# EAGLE design Adafruit tfttouchshield v2.2 (EAGLE 6.3)
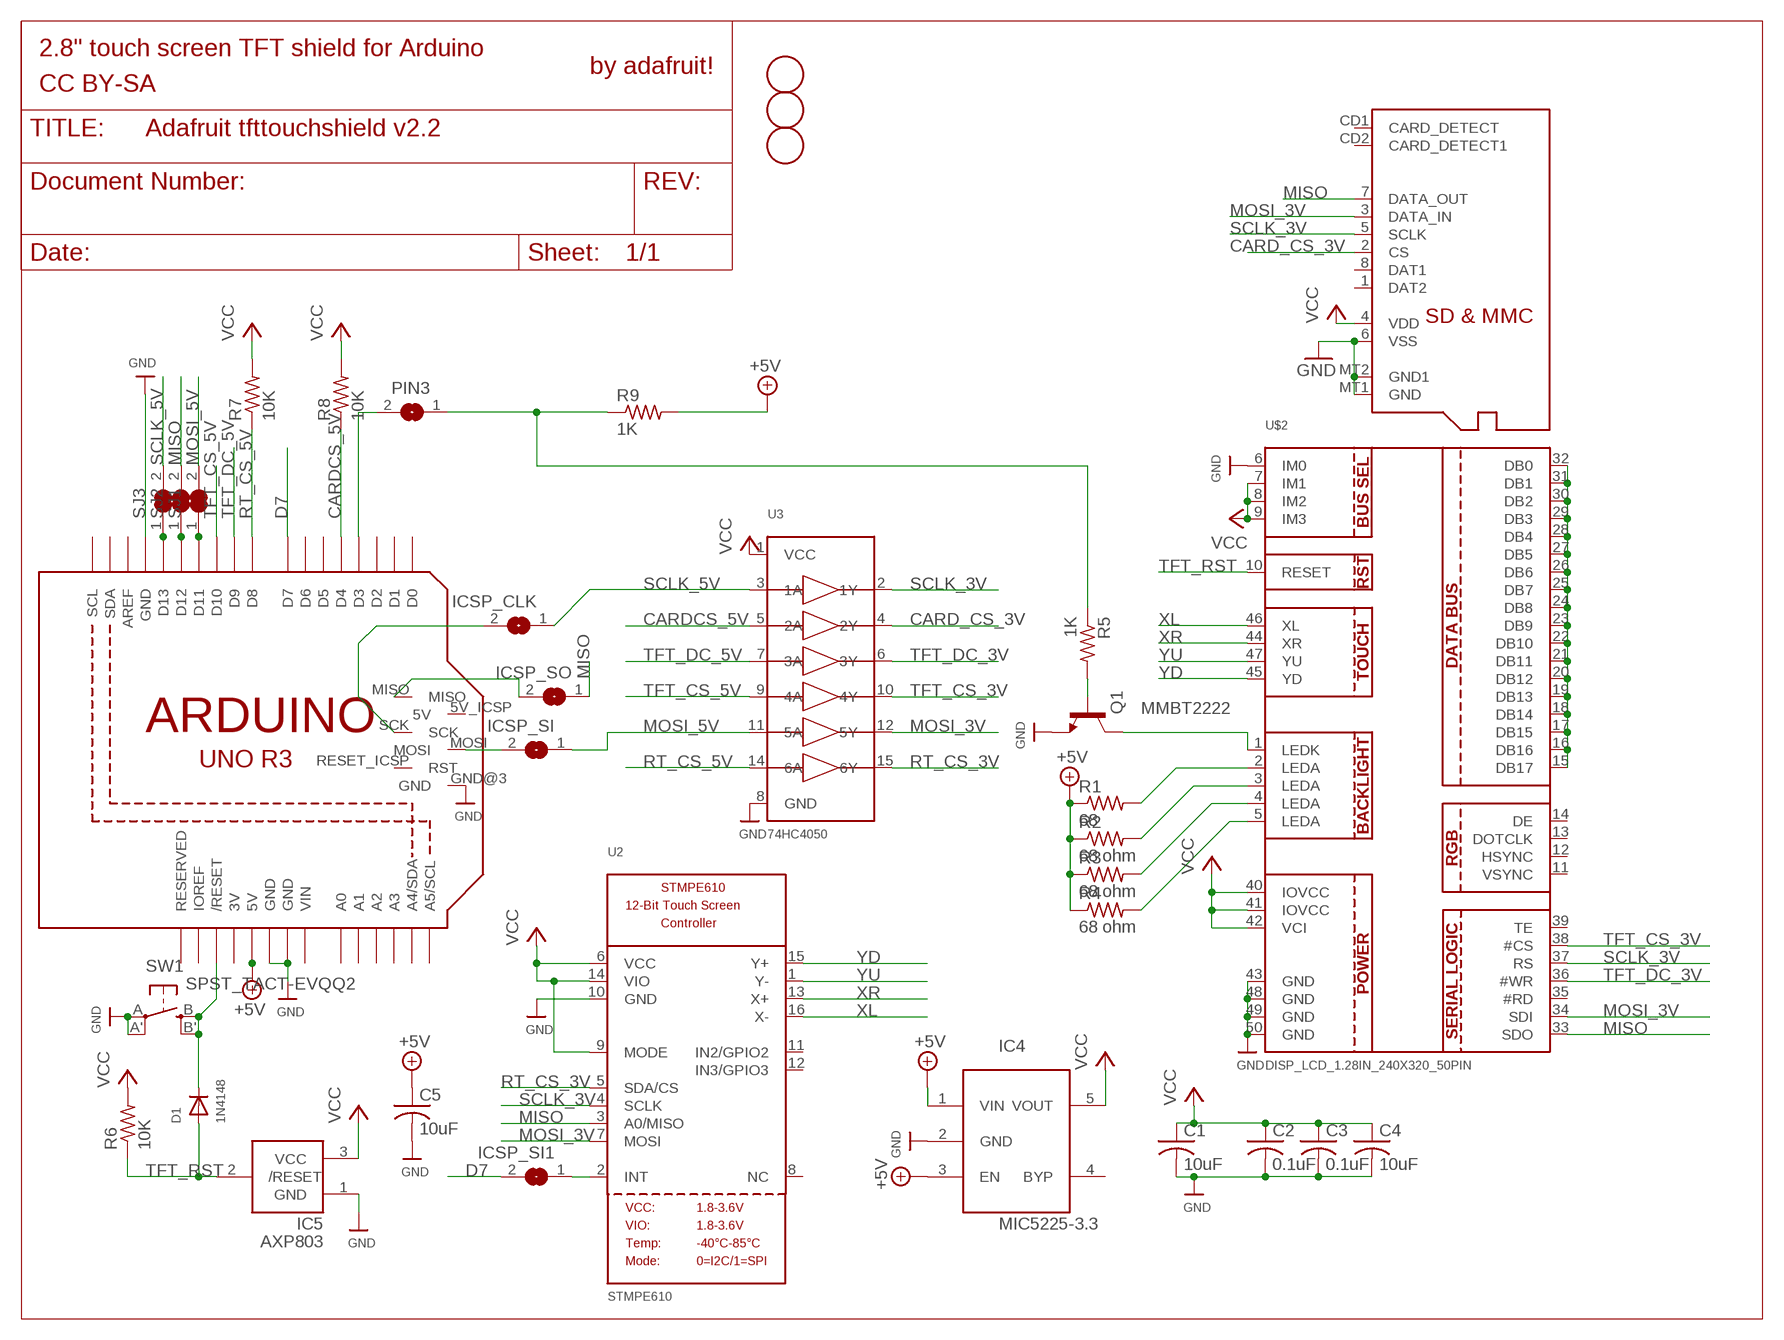
[diagram p0: schematic, sheet 1]

## Parts
C1  10uF  C-USC0805K  [C0805K]
C2  0.1uF  C-USC0805K  [C0805K]
C3  0.1uF  C-USC0805K  [C0805K]
C4  10uF  C-USC0805K  [C0805K]
C5  10uF  C-USC0805K  [C0805K]
D1  1N4148  DIODESOD-323F  [SOD-323F]
IC4  MIC5225-3.3  LP298XS  [SOT23-5L]
IC5  AXP803  AXP083-SAG  [SOT23]
ICSP_CLK  SOLDERJUMPERREFLOW_NOPASTE  [SOLDERJUMPER_REFLOW_NOPASTE]
ICSP_SI  SOLDERJUMPERREFLOW_NOPASTE  [SOLDERJUMPER_REFLOW_NOPASTE]
ICSP_SI1  SOLDERJUMPERREFLOW_NOPASTE  [SOLDERJUMPER_REFLOW_NOPASTE]
ICSP_SO  SOLDERJUMPERREFLOW_NOPASTE  [SOLDERJUMPER_REFLOW_NOPASTE]
PIN3  SOLDERJUMPERREFLOW_NOPASTE  [SOLDERJUMPER_REFLOW_NOPASTE]
Q1  MMBT2222  MMBT2222ALT1-NPN-SOT23-BEC  [SOT23-BEC]
R1  68  R-US_R0805  [R0805]
R2  68 ohm  R-US_R0805  [R0805]
R3  68 ohm  R-US_R0805  [R0805]
R4  68 ohm  R-US_R0805  [R0805]
R5  1K  R-US_R0805  [R0805]
R6  10K  R-US_R0805  [R0805]
R7  10K  R-US_R0805  [R0805]
R8  10K  R-US_R0805  [R0805]
R9  1K  R-US_R0805  [R0805]
SJ1  SOLDERJUMPER_CLOSED  [SOLDERJUMPER_CLOSEDWIRE]
SJ2  SOLDERJUMPER_CLOSED  [SOLDERJUMPER_CLOSEDWIRE]
SJ3  SOLDERJUMPER_CLOSED  [SOLDERJUMPER_CLOSEDWIRE]
SW1  SPST_TACT-EVQQ2  [EVQ-Q2]
U2  STMPE610  [QFN16_3MM]
U3  74HC4050  74HC4050D  [SOIC16]
U$2  DISP_LCD_1.28IN_240X320_50PIN  [TFT_2.83IN_240X320_50PIN]
U$3  MICROSD  [MICROSD]
U$10  FIDUCIAL  [FIDUCIAL_1MM]
U$11  FIDUCIAL  [FIDUCIAL_1MM]
U$17  ARDUINO_R3_ICSPSMT  [ARDUINOR3_ICSP_SMT]
U$19  FIDUCIAL  [FIDUCIAL_1MM]

## Nets
+5V: C5.1 IC4.1(VIN) IC4.3(EN) R1.1 R2.1 R3.1 R4.1 R9.2 U$17.5V
CARD_CS_3V: U3.4(2Y) U$3.2(CS)
CARDCS_5V: R8.1 U3.5(2A) U$17.D4
D7: ICSP_SI1.2 U$17.D7
GND: C1.2 C2.2 C3.2 C4.2 C5.2 IC4.2(GND) IC5.1(GND) Q1.E SW1.A'(P1) SW1.A(P) U2.10(GND) U3.8(GND) U$2.6(IM0) U$2.43(GND) U$2.48(GND) U$2.49(GND) U$2.50(GND) U$3.6(VSS) U$3.MT1(GND) U$3.MT2(GND1) U$17.GND U$17.GND@1(GND) U$17.GND@2(GND) U$17.GND@3(GND)
MISO: ICSP_SO.1 SJ2.2 U2.3(A0/MISO) U$2.33(SDO) U$3.7(DATA_OUT)
MOSI_3V: U2.7(MOSI) U3.12(5Y) U$2.34(SDI) U$3.3(DATA_IN)
MOSI_5V: ICSP_SI.1 SJ1.2 U3.11(5A)
N$1: Q1.C U$2.1(LEDK)
N$2: R1.2 U$2.2(LEDA)
N$3: R2.2 U$2.3(LEDA)
N$4: R3.2 U$2.4(LEDA)
N$5: PIN3.1 R5.1 R9.1
N$6: ICSP_SI.2 U$17.MOSI
N$7: PIN3.2 U$17.D3
N$8: D1.C SW1.B'(S1) SW1.B(S) U$17.RESET(/RESET)
N$9: U$2.15(DB17) U$2.16(DB16) U$2.17(DB15) U$2.18(DB14) U$2.19(DB13) U$2.20(DB12) U$2.21(DB11) U$2.22(DB10) U$2.23(DB9) U$2.24(DB8) U$2.25(DB7) U$2.26(DB6) U$2.27(DB5) U$2.28(DB4) U$2.29(DB3) U$2.30(DB2) U$2.31(DB1) U$2.32(DB0)
N$10: R4.2 U$2.5(LEDA)
N$11: ICSP_SO.2 U$17.MISO
N$12: ICSP_CLK.2 U$17.SCK
N$13: SJ3.1 U$17.D13
N$14: SJ2.1 U$17.D12
N$15: SJ1.1 U$17.D11
N$16: Q1.B R5.2
RT_CS_3V: U2.5(SDA/CS) U3.15(6Y)
RT_CS_5V: R7.1 U3.14(6A) U$17.D8
SCLK_3V: U2.4(SCLK) U3.2(1Y) U$2.37(RS) U$3.5(SCLK)
SCLK_5V: ICSP_CLK.1 SJ3.2 U3.3(1A)
TFT_CS_3V: U3.10(4Y) U$2.38(#CS)
TFT_CS_5V: U3.9(4A) U$17.D10
TFT_DC_3V: U3.6(3Y) U$2.36(#WR)
TFT_DC_5V: U3.7(3A) U$17.D9
TFT_RST: D1.A IC5.2(/RESET) R6.1 U$2.10(RESET)
TS_INT: ICSP_SI1.1 U2.2(INT)
VCC: C1.1 C2.1 C3.1 C4.1 IC4.5(VOUT) IC5.3(VCC) R6.2 R7.2 R8.2 U2.6(VCC) U2.9(MODE) U2.14(VIO) U3.1(VCC) U$2.7(IM1) U$2.8(IM2) U$2.9(IM3) U$2.40(IOVCC) U$2.41(IOVCC) U$2.42(VCI) U$3.4(VDD)
XL: U2.16(X-) U$2.46(XL)
XR: U2.13(X+) U$2.44(XR)
YD: U2.15(Y+) U$2.45(YD)
YU: U2.1(Y-) U$2.47(YU)
Unconnected: IC4.4(BYP) U2.8(NC) U2.11(IN2/GPIO2) U2.12(IN3/GPIO3) U$2.11(VSYNC) U$2.12(HSYNC) U$2.13(DOTCLK) U$2.14(DE) U$2.35(#RD) U$2.39(TE) U$3.1(DAT2) U$3.8(DAT1) U$3.CD1(CARD_DETECT) U$3.CD2(CARD_DETECT1) U$17.5V_ICSP(5V) U$17.A0 U$17.A1 U$17.A2 U$17.A3 U$17.A4(A4/SDA) U$17.A5(A5/SCL) U$17.AREF U$17.D0 U$17.D1 U$17.D2 U$17.D5 U$17.D6 U$17.IOREF U$17.RESERVED U$17.RESET_ICSP(RST) U$17.SCL U$17.SDA

## Notes on the sheet
- 2.8" touch screen TFT shield for Arduino
- by adafruit!
- CC BY-SA

## Power pins joined to a net without a drawn wire
3V: U$17.3V
VIN: U$17.VIN

## Library data of the parts
C1-C5 = adafruit:C-US: CAPACITOR, American symbol
D1 = adafruit:DIODE: Diode SMADIODE - SMA Surface Mount Package 20V 1A Schottky Diode Digikey: 641-1014-6-ND DO-1N4148 - Through Hole Small Current Diode SOD-123 20V 1 A (.5mV Vf) Schottky Diode - Digikey: MBRX120TPMSCT-ND SOD-323 10V 570mA (.38mV Vf, 3ns) Schottky Diode - Digikey: ZLLS410CT-ND SOD-523 30V 30mA Schottky Diode (RB751S-40TE61) - Digikey: RB751S-40TE61CT-ND SOT23-R/W - SOT23 Package (R = Solder Paste/Reflow Ovens, W = Hand-Soldering) BAT54Film 40V 300mA - Digikey: 497-7162-1-ND
IC4 = adafruit:LP298X
IC5 = adafruit:AXP083
ICSP_CLK ICSP_SI ICSP_SI1 ICSP_SO PIN3 = microbuilder:SOLDERJUMPER: SMD Solder JUMPER Solder the two pads together to create a connection, or remove the solder to break it. REFLOW - Use this footprint for solder paste and reflow ovens. WAVE - Use this footprint for hand-soldering (larger pads). CLOSED - Has a trace between the two pads to ensure it is closed by default. The trace needs to be cut to disable the jumper, and can be closed again by creating a solder bridge between the two pads.
Q1 = transistor-neu-to92:*-NPN-: NPN Transistror
R1-R9 = rcl:R-US_: RESISTOR, American symbol
SJ1-SJ3 = microbuilder:SOLDERJUMPER_CLOSED: Solder Jumper - Closed These solder jumpers are closed by default CLOSEDWIRE - 10 mil trace between pads that can be cut and resoldered later CLOSEDPERM - 63 mil trace between pads for a permanent connection (used to 'bridge' two signals, a shameless hack for Eagle). Can double as a test point as well (no cream layer)
SW1 = adafruit:SPST_TACT: SMT 6mm switch, EVQQ2 series http://www.ladyada.net/library/eagle
U2 = microbuilder:STMPE610: STMPE610 - 12-Bit Touch Screen Controller
U3 = microbuilder:74HC4050D: 6-channel level shifter 74HC4050D - 2V-6V Supply SOIC16 Digikey: 74HC4050D,653-ND Mouser: 771-74HC4050D-T TSSOP16 Digikey: 296-9215-1-ND Mouser:
U$2 = microbuilder:DISP_LCD_1.28IN_240X320_50PIN
U$3 = adafruit:MICROSD: Micro-SD / Transflash card holder with SPI pinout For the 3M # 2908-05WB-MG and/or 4UCON #19656 push-push type
U$10 U$11 U$19 = adafruit:FIDUCIAL: For use by pick and place machines to calibrate the vision/machine, 1mm By microbuilder.eu
U$17 = adafruit:ARDUINO_R3_ICSP

## Board
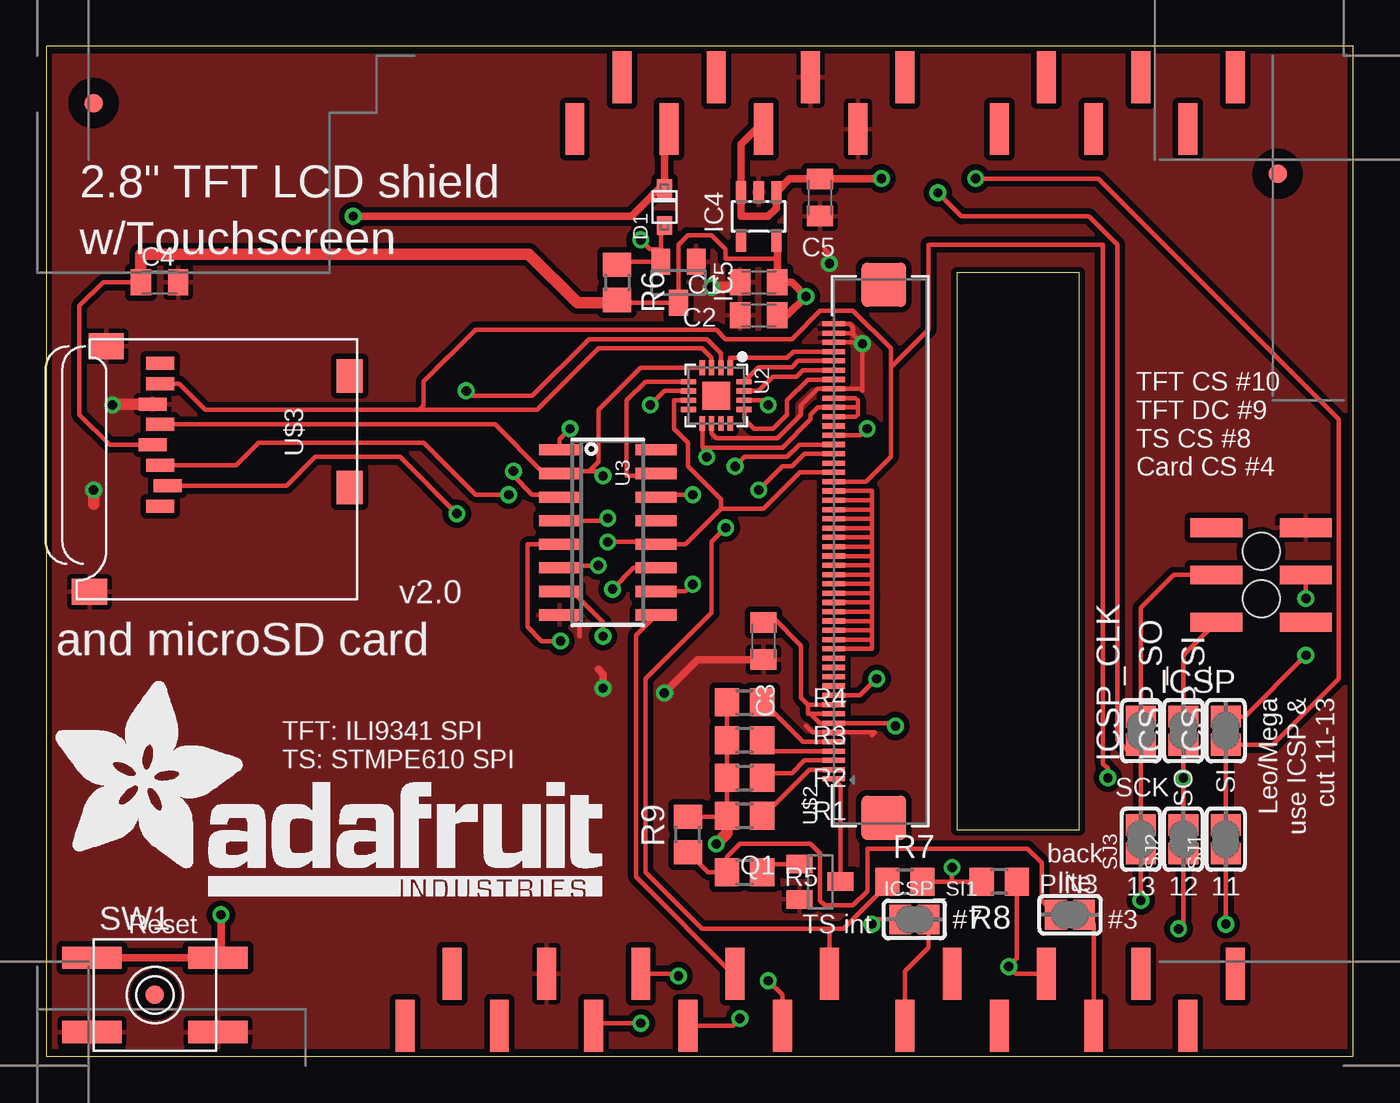
[diagram p1: board, top side]
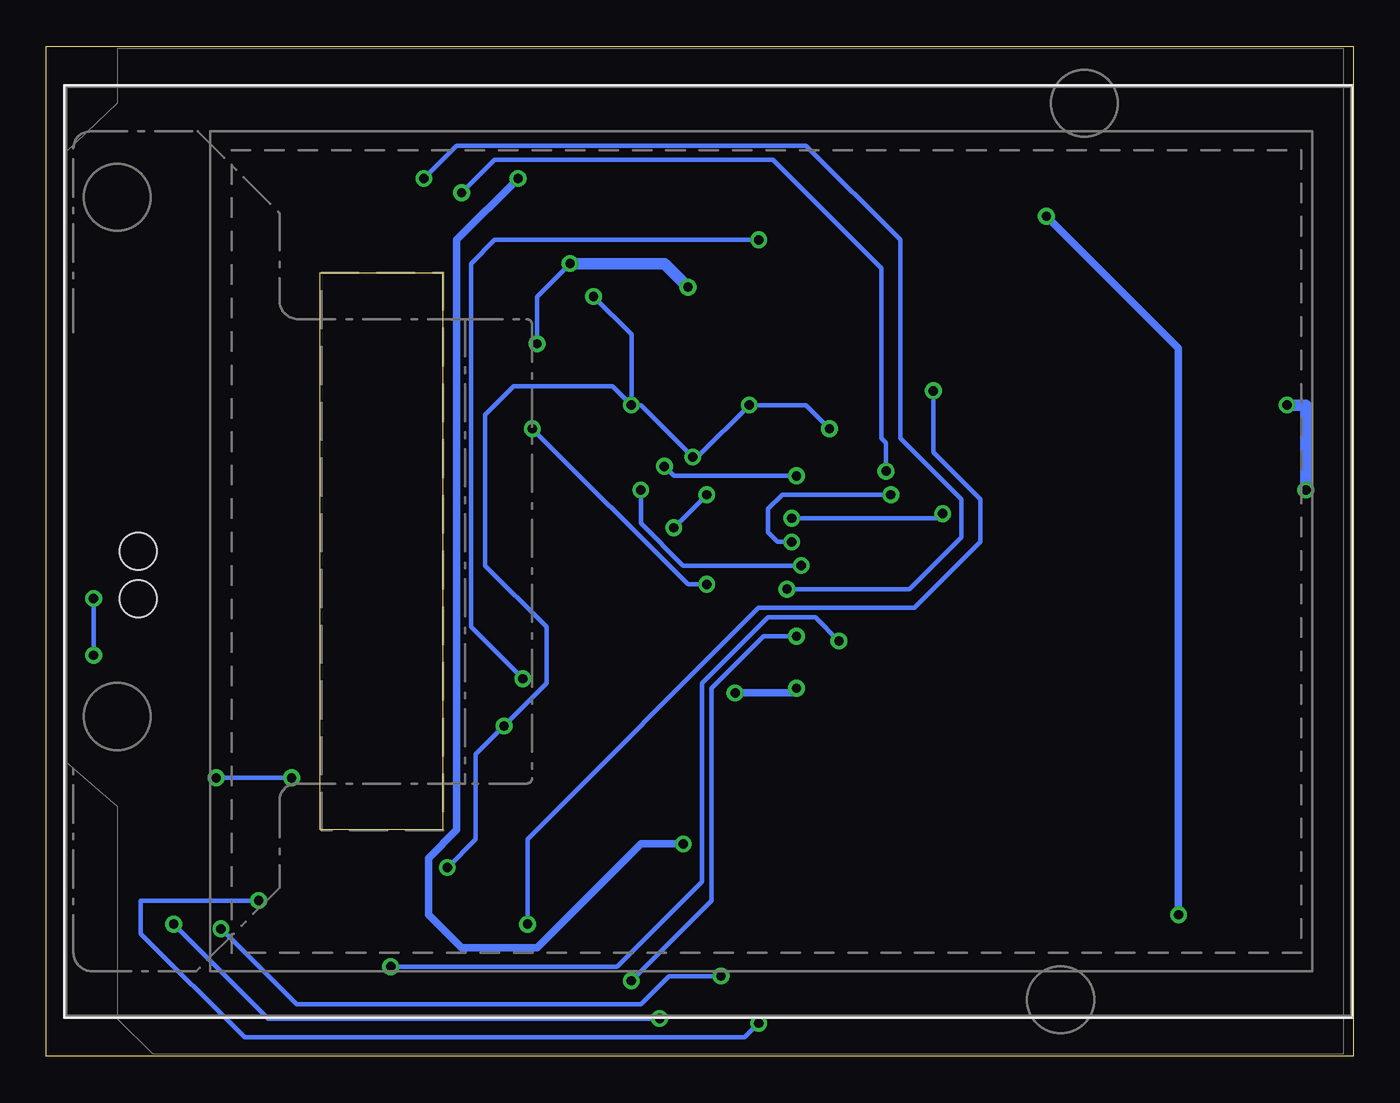
[diagram p2: board, bottom side, seen from below]

Size 70.36 x 54.36 mm. Coordinates in mm from the lower left corner, seen from the top.
Outline: 0,54.36 0,0 70.36,0 70.36,54.36 0,54.36
Outline: 49.02,42.16 49.02,12.19 55.63,12.19 55.63,42.16 49.02,42.16
Copper layers (1*16): Top 0.035mm / dielectric 1.5mm / Bottom 0.035mm
Design rules "adafruit": minimum track width 8mil, minimum drill 15.5mil, track to track 8mil, track to pad 8mil, pad to pad 8mil, via to via 8mil, smd to smd 8mil, copper to edge 10mil, drill to drill 8mil, minimum pad ring 10mil, minimum via ring 8mil, stop-mask expansion 4mil, vias tented up to drill 20mil, thermal gap 10mil
tRestrict: area 42.2,38.6 to 42.7,38.7; area 42.3,39.1 to 42.5,39.2

### Footprints (pad centres in the part's own frame; a part is rotated, then mirrored left to right if it is on the bottom)
C0805K = smd 1.1 x 1.4: 1 -1,0; 2 1,0
SOD-323F = smd 1 x 0.8: A -1,0; C 1,0
SOT23-5L = smd 0.55 x 1.2: 1 -0.95,-1.3; 2 0,-1.3; 3 0.95,-1.3; 4 0.95,1.3; 5 -0.95,1.3
SOT23 = smd 1 x 1.4: 1 -0.95,-1.1; 2 0.95,-1.1; 3 0,1.1
SOLDERJUMPER_REFLOW_NOPASTE = smd 1.168 x 1.6: 1 -0.762,0; 2 0.762,0
SOT23-BEC = smd 1 x 1.4: B -0.95,-1.1; C 0,1.1; E 0.95,-1.1
R0805 = smd 1.3 x 1.5: 1 -0.95,0; 2 0.95,0
SOLDERJUMPER_CLOSEDWIRE = smd 1.168 x 1.6: 1 -0.762,0; 2 0.762,0 | smd 0.635 x 0.203: WIRE 0,0
EVQ-Q2 = smd 3.2 x 1.2: A -3.4,-2; A' 3.4,-2; B -3.4,2; B' 3.4,2
QFN16_3MM = smd 0.8 x 0.28: 1 -1.5,0.75; 2 -1.5,0.25; 3 -1.5,-0.25; 4 -1.5,-0.75; 9 1.5,-0.75; 10 1.5,-0.25; 11 1.5,0.25; 12 1.5,0.75 | smd 0.28 x 0.8: 5 -0.75,-1.5; 6 -0.25,-1.5; 7 0.25,-1.5; 8 0.75,-1.5; 13 0.75,1.5; 14 0.25,1.5; 15 -0.25,1.5; 16 -0.75,1.5 | smd 1.5 x 1.5: THERMAL 0,0
SOIC16 = smd 0.6 x 2.2: 1 -4.445,-2.6; 2 -3.175,-2.6; 3 -1.905,-2.6; 4 -0.635,-2.6; 5 0.635,-2.6; 6 1.905,-2.6; 7 3.175,-2.6; 8 4.445,-2.6; 9 4.445,2.6; 10 3.175,2.6; 11 1.905,2.6; 12 0.635,2.6; 13 -0.635,2.6; 14 -1.905,2.6; 15 -3.175,2.6; 16 -4.445,2.6
TFT_2.83IN_240X320_50PIN = smd 0.275 x 1.2 bottom: 1 12.25,-10.39; 2 11.75,-10.39; 3 11.25,-10.39; 4 10.75,-10.39; 5 10.25,-10.39; 6 9.75,-10.39; 7 9.25,-10.39; 8 8.75,-10.39; 9 8.25,-10.39; 10 7.75,-10.39; 11 7.25,-10.39; 12 6.75,-10.39; 13 6.25,-10.39; 14 5.75,-10.39; 15 5.25,-10.39; 16 4.75,-10.39; 17 4.25,-10.39; 18 3.75,-10.39; 19 3.25,-10.39; 20 2.75,-10.39; 21 2.25,-10.39; 22 1.75,-10.39; 23 1.25,-10.39; 24 0.75,-10.39; 25 0.25,-10.39; 26 -0.25,-10.39; 27 -0.75,-10.39; 28 -1.25,-10.39; 29 -1.75,-10.39; 30 -2.25,-10.39; 31 -2.75,-10.39; 32 -3.25,-10.39; 33 -3.75,-10.39; 34 -4.25,-10.39; 35 -4.75,-10.39; 36 -5.25,-10.39; 37 -5.75,-10.39; 38 -6.25,-10.39; 39 -6.75,-10.39; 40 -7.25,-10.39; 41 -7.75,-10.39; 42 -8.25,-10.39; 43 -8.75,-10.39; 44 -9.25,-10.39; 45 -9.75,-10.39; 46 -10.25,-10.39; 47 -10.75,-10.39; 48 -11.25,-10.39; 49 -11.75,-10.39; 50 -12.25,-10.39 | smd 2.4 x 2.4 bottom: PAD1 14.35,-13.09; PAD2 -14.35,-13.09
MICROSD = smd 0.7 x 1.5: 1 9,-10.64; 2 7.9,-10.24; 3 6.8,-10.64; 4 5.7,-11.04; 5 4.6,-10.64; 6 3.5,-11.04; 7 2.4,-10.64; 8 1.3,-10.64 | smd 1.8 x 1.4: CD1 2,-0.44; CD2 8,-0.44 | smd 1.4 x 1.9: MT1 0.4,-13.54; MT2 13.6,-14.44
FIDUCIAL_1MM = smd 1 x 1: 1 0,0
ARDUINOR3_ICSP_SMT = smd 1.016 x 2.794 bottom: 3V 35.56,1.143; 5V 38.1,3.937; A0 50.8,3.937; A1 53.34,1.143; A2 55.88,3.937; A3 58.42,1.143; A4 60.96,3.937; A5 63.5,1.143; AREF 23.876,52.197; D0 63.5,49.403; D1 60.96,52.197; D2 58.42,49.403; D3 55.88,52.197; D4 53.34,49.403; D5 50.8,52.197; D6 48.26,49.403; D7 45.72,52.197; D8 41.656,49.403; D9 39.116,52.197; D10 36.576,49.403; D11 34.036,52.197; D12 31.496,49.403; D13 28.956,52.197; GND 26.416,49.403; GND@1 43.18,3.937; GND@2 40.64,1.143; IOREF 30.48,1.143; RESERVED 27.94,3.937; RESET 33.02,3.937; SCL 18.796,52.197; SDA 21.336,49.403; VIN 45.72,1.143 | smd 2.794 x 1.016 bottom: 5V_ICSP 67.31,30.48; GND@3 67.31,25.4; MISO 62.484,30.48; MOSI 67.31,27.94; RESET_ICSP 62.484,25.4; SCK 62.484,27.94 | hole 2: 64.897,29.21; 64.897,26.67

### Placement (x,y rotation side)
C1  38.35,41.66 180 top
C2  38.35,39.88 180 top
C3  38.61,22.35 270 top
C4  6.1,41.66 0 top
C5  41.66,46.23 270 top
D1  33.27,45.72 90 top
IC4  38.35,45.21 180 top
IC5  34.04,41.66 180 top
ICSP_CLK  58.93,17.53 90 top
ICSP_SI  63.5,17.53 90 top
ICSP_SI1  46.74,7.37 0 top
ICSP_SO  61.21,17.53 90 top
PIN3  55.12,7.62 0 top
Q1  41.66,9.4 270 top
R1  37.59,12.95 0 top
R2  37.59,14.99 0 top
R3  37.59,17.02 0 top
R4  37.59,19.05 0 top
R5  37.59,9.91 0 top
R6  30.73,41.66 270 top
R7  46.23,9.4 0 top
R8  51.31,9.4 180 top
R9  34.54,11.94 90 top
SJ1  63.5,11.68 90 top
SJ2  61.21,11.68 90 top
SJ3  58.93,11.68 90 top
SW1  5.84,3.3 0 top
U2  36.07,35.56 270 top
U3  30.23,28.19 270 top
U$2  32,27.18 270 bottom
U$3  16.76,38.61 270 top
U$10  66.29,47.5 180 top
U$11  5.84,3.3 180 top
U$17  0.51,53.85 180 bottom
U$19  2.54,51.31 0 top
U$20  [ADAFRUIT_TEXT_30MM]  0.25,8.64 0 top

### Tracks (layer width: path | path; a pad name or v marks a point on that pad's centre or on a via)
+5V  (via drill 0.5)
  Top 0.254: R9.2 36.58,12.89 R1.1 R2.1 R3.1 R4.1
  Top 0.406: v44.96,47.24 41.67,47.24 C5.1 40.02,47.23 IC4.1 39.3,45.65 38.86,45.21 37.4,45.21 IC4.3 37.4,49.09 38.61,50.29 U$17.5V
  Top 0.61: v36.07,11.43 36.64,12 R1.1
  Bottom 0.406: v36.07,11.43 38.35,11.43 43.94,5.84 48.01,5.84 49.78,7.62 49.78,10.67 48.26,12.19 48.26,43.94 v44.96,47.24
CARD_CS_3V  (via drill 0.5)
  Top 0.254: U$3.2 12.93,30.71 14.48,32.26 19.05,32.26 v22.1,29.21 | v30.23,28.96 30.1,28.83 U3.4
  Bottom 0.254: v22.1,29.21 22.35,28.96 v30.23,28.96
CARDCS_5V  (via drill 0.5)
  Top 0.254: U3.5 25.91,27.56 25.91,23.11 26.67,22.35 v27.69,22.35 | U$17.D4 52.2,4.45 v51.82,4.83 52.26,5.27 R8.1
  Bottom 0.254: v27.69,22.35 28.96,23.62 31.5,23.62 35.05,20.07 35.05,9.4 39.62,4.83 v51.82,4.83
D7
  Top 0.254: U$17.D7 46.23,4.57 47.5,5.84 ICSP_SI1.2
GND  (via drill 0.5)
  Top 0.254: 44.45,17.27 44.61,17.43 U$2.6 41.25,17.43 40.89,17.78 | U$2.48 43.87,38.43 v43.94,38.35 | U2.10 35.82,33.52 36.07,33.27 39.37,33.27 40.64,34.54 40.64,35.05 41.52,35.93 U$2.43 43.83,35.93 43.94,35.81 v43.94,38.35 | v42.16,42.67 42.16,43.18 41.91,43.43 | U3.8 28.07,23.75 28.7,23.11 28.7,22.61 | U$2.50 43.25,39.43 43.43,39.24 43.43,38.86 v43.94,38.35 | U$2.49 43.37,38.93 v43.94,38.35
  Top 0.406: C3.2 35.07,21.35 v33.27,19.56 | v29.97,19.81 29.97,20.57 29.72,20.83
  Top 0.61: C1.2 37.1,41.4 v35.81,41.4 | U$3.6 3.56,35.11 v3.56,35.05 | v2.54,30.48 2.54,29.72
  Bottom 0.254: v43.94,38.35 43.94,40.89 v42.16,42.67
  Bottom 0.406: v33.27,19.56 30.23,19.56 v29.97,19.81
  Bottom 0.61: v35.81,41.4 37.08,42.67 v42.16,42.67 | v3.56,35.05 2.54,35.05 v2.54,30.48
  pour Top (isolate 0.305): -0.25,0.51 -0.25,53.85 70.36,53.85 70.36,0.51
MISO  (via drill 0.5)
  Top 0.254: 42.42,30.9 U$2.33 44.14,30.93 45.47,32.26 45.47,37.08 | 45.47,37.08 45.47,38.1 43.43,40.13 41.66,40.13 40.13,38.61 36.58,38.61 36.07,39.12 23.11,39.12 20.32,36.32 20.32,35.05 20.07,34.8 | 20.07,34.8 8.55,34.8 7.14,36.21 U$3.7 | 20.07,34.8 26.42,34.8 29.72,38.1 35.31,38.1 35.82,37.59 U2.3 | ICSP_SO.1 v61.21,14.99 SJ2.2 | v57.15,14.99 57.15,15.49 56.9,15.75 56.9,43.69 47.5,43.69 47.5,39.12 45.47,37.08
  Bottom 0.254: v57.15,14.99 v61.21,14.99
MOSI_3V  (via drill 0.5)
  Top 0.254: 36.32,29.46 34.42,27.56 U3.12 32.7,27.69 v30.23,27.69 | 36.32,29.46 36.32,29.97 34.54,31.75 34.54,33.02 33.78,33.78 33.78,35.31 U2.7 | U$2.34 40.57,31.43 38.61,29.46 36.32,29.46 | U$3.3 10.22,31.81 11.43,33.02 20.32,33.02 23.11,30.23 v24.89,30.23
  Bottom 0.254: v30.23,27.69 30.99,27.69 31.5,28.19 31.5,29.46 30.73,30.23 v24.89,30.23
MOSI_5V  (via drill 0.5)
  Top 0.254: SJ1.2 ICSP_SI.1 66.04,16.76 69.6,20.32 69.6,34.29 56.64,47.24 v50.04,47.24 | v30.48,25.15 31.62,26.29 U3.11
  Bottom 0.254: v50.04,47.24 48.26,49.02 29.46,49.02 24.38,43.94 24.38,33.27 21.08,29.97 21.08,27.94 23.88,25.15 v30.48,25.15
N$1
  Top 0.254: Q1.C 42.76,14.57 U$2.1
N$2
  Top 0.254: U$2.2 41.08,15.43 38.61,12.95 R1.2
N$3
  Top 0.254: U$2.3 40.82,15.93 40.13,15.24 38.8,15.24 R2.2
N$4
  Top 0.254: U$2.4 39.13,16.43 R3.2
N$5
  Top 0.254: PIN3.1 53.59,8.38 53.59,10.41 52.83,11.18 44.2,11.18 44.2,8.89 43.43,8.13 41.91,8.13 41.66,8.38 41.66,10.92 41.15,11.43 37.34,11.43 36.64,10.73 R5.1 35.63,9.91 R9.1
N$6  (via drill 0.5)
  Top 0.254: ICSP_SI.2 64.52,18.29 v67.82,21.59 | v67.82,24.64 U$17.MOSI
  Bottom 0.254: v67.82,21.59 v67.82,24.64
N$7
  Top 0.254: PIN3.2 56.39,7.11 U$17.D3
N$8  (via drill 0.5)
  Top 0.406: SW1.B SW1.B' 9.4,5.3 v9.4,7.62 | v16.51,45.21 31.51,45.21 33.02,46.72 D1.C 33.27,49.66 U$17.RESET
  Bottom 0.406: v9.4,7.62 9.4,38.1 v16.51,45.21
N$9
  Top 0.254: U$2.15 44.45,21.93 44.45,22.43 | 44.45,22.43 44.45,22.93 | 44.45,22.93 44.45,23.43 | 44.45,23.43 44.45,23.93 | 44.45,23.93 44.45,24.43 | 44.45,24.93 44.45,25.43 | 44.45,25.43 44.45,25.93 | 44.45,25.93 44.45,26.43 | 44.45,26.43 44.45,26.93 | 44.45,26.93 44.45,27.43 | 44.45,27.43 44.45,27.93 | 44.45,27.93 44.45,28.43 | 44.45,28.43 44.45,28.93 | 44.45,28.93 44.45,29.43 | 44.45,29.43 44.45,29.93 | 44.45,29.93 44.45,30.43 U$2.32 | U$2.31 44.45,29.93 | U$2.30 44.45,29.43 | U$2.29 44.45,28.93 | U$2.28 44.45,28.43 | U$2.27 44.45,27.93 | U$2.26 44.45,27.43 | U$2.25 44.45,26.93 | U$2.24 44.45,26.43 | U$2.23 44.45,25.93 | U$2.22 44.45,25.43 | U$2.21 44.45,24.93 | 44.45,24.93 44.45,24.43 | U$2.20 44.45,24.43 | U$2.19 44.45,23.93 | U$2.18 44.45,23.43 | U$2.17 44.45,22.93 | U$2.16 44.45,22.43
N$10
  Top 0.254: U$2.5 40.73,16.93 38.61,19.05 R4.2
N$11
  Top 0.254: ICSP_SO.2 61.21,21.59 U$17.MISO
N$12
  Top 0.254: ICSP_CLK.2 58.93,24.13 60.71,25.91 U$17.SCK
N$13  (via drill 0.5)
  Top 0.254: U$17.D13 29.59,1.78 v32,1.78 | v58.93,8.38 SJ3.1
  Bottom 0.254: v32,1.78 32.77,1.02 59.69,1.02 65.28,6.6 65.28,8.38 v58.93,8.38
N$14  (via drill 0.5)
  Top 0.254: SJ2.1 61.21,7.11 v60.96,6.86 | v34.04,4.32 33.91,4.45 U$17.D12
  Bottom 0.254: v60.96,6.86 56.9,2.79 38.35,2.79 36.83,4.32 v34.04,4.32
N$15  (via drill 0.5)
  Top 0.254: SJ1.1 v63.5,7.11 | v37.34,2.03 36.96,1.65 U$17.D11
  Bottom 0.254: v63.5,7.11 58.42,2.03 v37.34,2.03
N$16
  Top 0.254: Q1.B 38.86,10.35 38.54,10.03 R5.2
RT_CS_3V
  Top 0.254: U2.5 32.25,36.31 31.24,35.31 31.24,31.24 32.95,31.24 U3.15
RT_CS_5V  (via drill 0.5)
  Top 0.254: 42.16,6.86 35.31,6.86 32.26,9.91 32.26,20.32 35.81,23.88 35.81,27.69 v36.58,28.45 | v34.8,30.23 32.95,30.23 U3.14 | U$17.D8 42.16,6.86 | 42.16,6.86 42.93,6.86 45.21,9.14 45.21,9.33 R7.1
  Bottom 0.254: v36.58,28.45 v34.8,30.23
SCLK_3V  (via drill 0.5)
  Top 0.254: U2.4 31.98,37.06 29.72,34.8 29.72,32 29.21,31.5 | 29.21,31.5 27.75,31.5 U3.2 27.5,31.5 26.67,31.5 24.16,34.01 U$3.5 | v29.97,31.24 29.72,31.5 29.21,31.5 | U$2.37 40.55,32.93 39.88,32.26 37.59,32.26 v37.08,31.75
  Bottom 0.254: v37.08,31.75 36.58,31.24 v29.97,31.24
SCLK_5V  (via drill 0.5)
  Top 0.254: ICSP_CLK.1 58.93,16.51 | 58.93,16.51 SJ3.2 | 58.93,16.51 58.17,16.51 57.66,17.02 57.66,43.69 56.13,45.21 49.28,45.21 v48.01,46.48 | v25.15,31.5 25.15,31.24 26.16,30.23 27.5,30.23 U3.3
  Bottom 0.254: v48.01,46.48 46.23,48.26 31.24,48.26 25.4,42.42 25.4,33.27 25.15,33.02 v25.15,31.5
TFT_CS_3V  (via drill 0.5)
  Top 0.254: U3.10 34.42,25.02 v34.8,25.4 | v44.2,33.78 43.84,33.43 U$2.38
  Bottom 0.254: v34.8,25.4 35.81,25.4 v44.2,33.78
TFT_CS_5V
  Top 0.254: U$17.D10 37.08,4.32 31.75,9.65 31.75,22.67 U3.9
TFT_DC_3V  (via drill 0.5)
  Top 0.254: v29.72,26.42 27.75,26.42 U3.6 | U$2.36 40.81,32.43 40.13,31.75 39.62,31.75 v38.35,30.48
  Bottom 0.254: v29.72,26.42 36.07,26.42 38.35,28.7 v38.35,30.48
TFT_DC_5V  (via drill 0.5)
  Top 0.254: v29.97,22.61 29.97,23.37 28.19,25.15 27.75,25.15 U3.7 | U$17.D9 39.62,3.3 v38.86,4.06
  Bottom 0.254: v29.97,22.61 31.75,22.61 34.54,19.81 34.54,8.38 v38.86,4.06
TFT_RST  (via drill 0.5)
  Top 0.254: D1.A 33.09,44.53 33.09,43.43 | 33.09,43.43 IC5.2 30.88,42.76 R6.1 | U$2.10 43.81,19.43 v44.7,20.32 | v32,43.94 32.51,43.43 33.09,43.43
  Bottom 0.254: v44.7,20.32 47.5,23.11 47.5,42.67 46.23,43.94 v32,43.94
TS_INT  (via drill 0.5)
  Top 0.254: U2.2 36.32,37.85 35.56,38.61 29.21,38.61 26.16,35.56 22.86,35.56 v22.61,35.81 | v44.45,7.11 44.7,7.37 ICSP_SI1.1
  Bottom 0.254: v22.61,35.81 22.61,32.51 20.07,29.97 20.07,27.69 23.62,24.13 32,24.13 44.45,11.68 v44.45,7.11
VCC  (via drill 0.5)
  Top 0.254: U$2.9 41.02,18.93 | 41.02,18.93 40.64,19.3 40.64,22.1 39.12,23.62 38.88,23.62 C3.1 | R6.2 30.88,40.56 31.24,40.56 IC5.3 34.04,43.69 34.54,44.2 35.81,44.2 36.58,43.43 36.58,42.93 39.35,42.93 | U2.9 35.32,32.77 35.56,32.77 | U$3.4 3.41,32.91 1.78,34.54 1.78,40.39 3.05,41.66 C4.1 | U2.14 38.6,35.31 v38.86,35.05 | v35.56,32.26 35.56,32.77 | v45.72,17.78 45.57,17.93 U$2.7 41.65,17.93 41.15,18.43 | U2.6 33.27,35.81 v32.51,35.05 | U3.1 27.63,33.21 v28.19,33.78 | 35.56,32.77 39.62,32.77 41.15,34.29 41.15,34.54 41.53,34.93 U$2.41 43.69,34.93 43.69,34.92 | IC4.5 39.35,43.86 39.35,43.61 | R7.2 48.77,9.4 | 48.77,9.4 R8.2 | v48.77,10.16 48.77,9.4 | 41.02,18.93 41.02,18.43 41.15,18.43 | U$2.8 41.15,18.43 | U$2.42 43.57,35.43 43.69,35.31 43.69,34.92 | 43.69,34.92 43.69,34.54 43.56,34.42 42.41,34.42 U$2.40
  Top 0.406: 39.35,43.61 39.35,42.93 C1.1 40.13,41.66 v40.89,40.89 39.88,39.88 C2.1
  Top 0.61: 31.24,40.56 28.6,40.56 25.97,43.18 5.08,43.18 5.08,41.67 C4.1
  Bottom 0.254: v38.86,35.05 38.35,35.05 v35.56,32.26 35.31,32.26 v32.51,35.05 29.46,35.05 v28.19,33.78 | v40.89,40.89 38.86,38.86 v38.86,35.05 | v38.86,35.05 39.88,36.07 45.21,36.07 46.74,34.54 46.74,26.42 43.43,23.11 43.43,20.07 v45.72,17.78 47.24,16.26 47.24,11.68 v48.77,10.16
XL
  Top 0.254: U$2.46 40.48,37.43 40.13,37.08 38.34,37.08 U2.16
XR
  Top 0.254: 37.58,34.8 U2.13 37.59,34.79 37.59,34.29 38.1,33.78 39.12,33.78 39.88,34.54 39.88,35.31 41,36.43 U$2.44
YD
  Top 0.254: U2.15 38.35,35.81 39.12,36.58 40.39,36.58 40.74,36.93 U$2.45
YU
  Top 0.254: U2.1 36.82,37.59 39.88,37.59 40.21,37.93 U$2.47

### Text on the board
tPlace: 2.8" TFT LCD shield | w/Touchscreen | TFT CS #10 / TFT DC #9 / TS CS #8 / Card CS #4 | v2.0 | and microSD card | ICSP | Leo/Mega / use ICSP & / cut 11-13 | TFT: ILI9341 SPI / TS: STMPE610 SPI | SCK | SO | SI | back / lite | 13 | 12 | 11 | Reset | TS int | #7 | #3